# EAGLE design adi-interface(v2) (EAGLE 7.6.0)

## Sheet 1 of 2
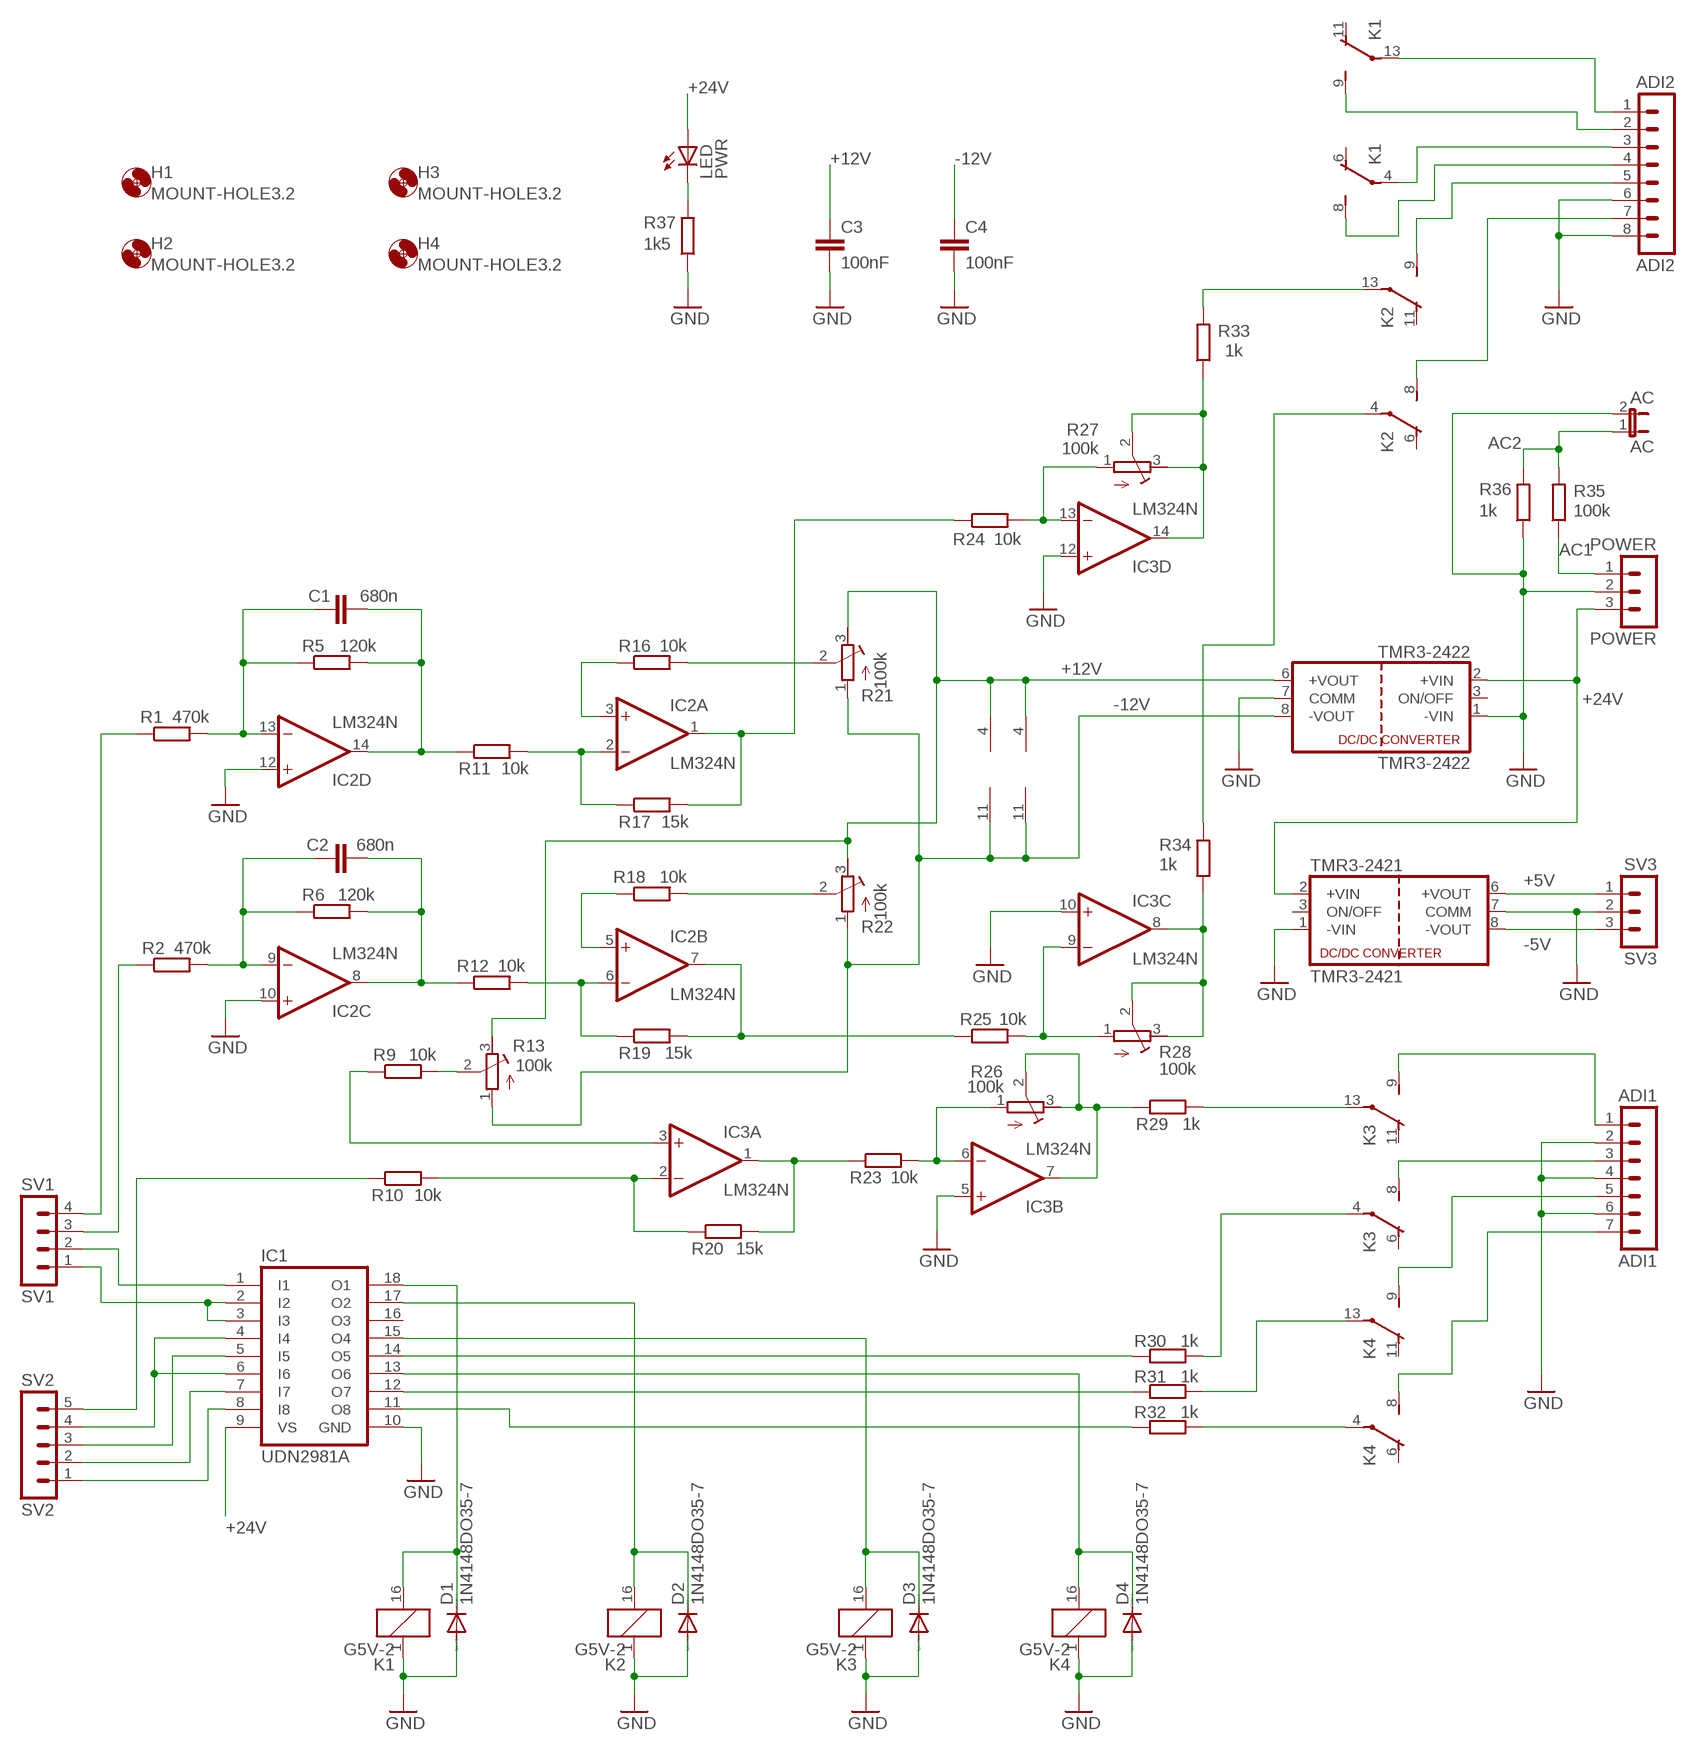
[diagram p0: schematic, sheet 1]

### Parts
AC  AC  JUMPER-2PTH  [1X02]
ADI1  ADI1  MA07-1  [MA07-1]
ADI2  ADI2  MA08-1  [MA08-1]
C1  680n  C-EU050-035X075  [C050-035X075]
C2  680n  C-EU050-035X075  [C050-035X075]
C3  100nF  C-EU025-024X044  [C025-024X044]
C4  100nF  C-EU025-024X044  [C025-024X044]
D1  1N4148DO35-7  [DO35-7]
D2  1N4148DO35-7  [DO35-7]
D3  1N4148DO35-7  [DO35-7]
D4  1N4148DO35-7  [DO35-7]
H1  MOUNT-HOLE3.2  [3,2]
H2  MOUNT-HOLE3.2  [3,2]
H3  MOUNT-HOLE3.2  [3,2]
H4  MOUNT-HOLE3.2  [3,2]
IC1  UDN2981A  [DIL18]
IC2  LM324N  [DIL14]
IC3  LM324N  [DIL14]
K1  G5V-2  [G5V-2]
K2  G5V-2  [G5V-2]
K3  G5V-2  [G5V-2]
K4  G5V-2  [G5V-2]
LED  PWR  LED3MM  [LED3MM]
POWER  POWER  MA03-1  [MA03-1]
R1  470k  R-EU_0204/7  [0204/7]
R2  470k  R-EU_0204/7  [0204/7]
R5  120k  R-EU_0204/7  [0204/7]
R6  120k  R-EU_0204/7  [0204/7]
R9  10k  R-EU_0204/7  [0204/7]
R10  10k  R-EU_0204/7  [0204/7]
R11  10k  R-EU_0204/7  [0204/7]
R12  10k  R-EU_0204/7  [0204/7]
R13  100k  R-TRIMM64Z  [RTRIM64Z]
R16  10k  R-EU_0204/7  [0204/7]
R17  15k  R-EU_0204/7  [0204/7]
R18  10k  R-EU_0204/7  [0204/7]
R19  15k  R-EU_0204/7  [0204/7]
R20  15k  R-EU_0204/7  [0204/7]
R21  100k  R-TRIMM64Z  [RTRIM64Z]
R22  100k  R-TRIMM64Z  [RTRIM64Z]
R23  10k  R-EU_0204/7  [0204/7]
R24  10k  R-EU_0204/7  [0204/7]
R25  10k  R-EU_0204/7  [0204/7]
R26  100k  R-TRIMM64Z  [RTRIM64Z]
R27  100k  R-TRIMM64Z  [RTRIM64Z]
R28  100k  R-TRIMM64Z  [RTRIM64Z]
R29  1k  R-EU_0204/7  [0204/7]
R30  1k  R-EU_0204/7  [0204/7]
R31  1k  R-EU_0204/7  [0204/7]
R32  1k  R-EU_0204/7  [0204/7]
R33  1k  R-EU_0204/7  [0204/7]
R34  1k  R-EU_0204/7  [0204/7]
R35  100k  R-EU_0204/7  [0204/7]
R36  1k  R-EU_0204/7  [0204/7]
R37  1k5  R-EU_0204/7  [0204/7]
SV1  SV1  MA04-1  [MA04-1]
SV2  SV2  MA05-1  [MA05-1]
SV3  SV3  MA03-1  [MA03-1]
TMR3-2421  TMR3-2421  TMR  [TRACO_SIP-8]
TMR3-2422  TMR3-2422  TMR  [TRACO_SIP-8]

### Nets
+5V [+5V]: SV3.1 TMR3-2421.6(+VOUT)
+12V [+12V]: C3.1 IC2.4(P:V+) IC3.4(P:V+) R13.3(E) R21.3(E) R22.3(E) TMR3-2422.6(+VOUT) ; also sheet 2
+24V [+24V]: IC1.9(VS) LED.A POWER.3 TMR3-2421.2(+VIN) TMR3-2422.2(+VIN)
-5V [-5V]: SV3.3 TMR3-2421.8(-VOUT)
-12V [-12V]: C4.1 IC2.11(P:V-) IC3.11(P:V-) R13.1(A) R21.1(A) R22.1(A) TMR3-2422.8(-VOUT) ; also sheet 2
AC1 [AC1]: POWER.1 R35.1
AC2 [AC2]: AC.1 R35.2 R36.2
GND [GND]: AC.2 ADI1.2 ADI1.4 ADI1.6 ADI2.6 ADI2.8 C3.2 C4.2 D1.A D2.A D3.A D4.A IC1.10(GND) IC2.10(C:+IN) IC2.12(D:+IN) IC3.5(B:+IN) IC3.10(C:+IN) IC3.12(D:+IN) K1.1 K2.1 K3.1 K4.1 POWER.2 R36.1 R37.1 SV3.2 TMR3-2421.1(-VIN) TMR3-2421.7(COMM) TMR3-2422.1(-VIN) TMR3-2422.7(COMM) ; also sheet 2
N$13: ADI2.1 K1.13(2:P)
N$14: ADI2.2 K1.9(2:S)
N$15: ADI2.3 K1.4(1:P)
N$16: ADI2.4 K1.8(1:S)
N$17: ADI2.5 K2.9(2:S)
N$18: ADI2.7 K2.8(1:S)
N$19: D1.C IC1.18(O1) K1.16
N$20: ADI1.1 K3.9(2:S)
N$21: D2.C IC1.17(O2) K2.16
N$22: ADI1.3 K3.8(1:S)
N$23: ADI1.5 K4.9(2:S)
N$24: ADI1.7 K4.8(1:S)
N$25: K3.4(1:P) R30.2
N$26: K4.13(2:P) R31.2
N$27: IC1.2(I2) IC1.3(I3) SV1.1
N$28: IC1.1(I1) SV1.2
N$29: K4.4(1:P) R32.2
N$30: D4.C IC1.13(O6) K4.16
N$31: D3.C IC1.15(O4) K3.16
N$32: IC1.11(O8) R32.1
N$33: IC1.12(O7) R31.1
N$34: R2.1 SV1.3
N$35: C2.1 IC2.9(C:-IN) R2.2 R6.1
N$36: C2.2 IC2.8(C:OUT) R6.2 R12.1
N$37: R1.1 SV1.4
N$38: IC2.2(A:-IN) R11.2 R17.1
N$39: C1.2 IC2.14(D:OUT) R5.2 R11.1
N$40: C1.1 IC2.13(D:-IN) R1.2 R5.1
N$41: K2.13(2:P) R33.2
N$42: IC2.1(A:OUT) R17.2 R24.1
N$43: IC2.6(B:-IN) R12.2 R19.1
N$44: K2.4(1:P) R34.2
N$45: IC2.7(B:OUT) R19.2 R25.1
N$46: IC2.3(A:+IN) R16.1
N$47: IC2.5(B:+IN) R18.1
N$48: R16.2 R21.2(S)
N$49: R18.2 R22.2(S)
N$50: LED.K(C) R37.2
N$52: IC3.6(B:-IN) R23.2 R26.1(A)
N$53: IC3.7(B:OUT) R26.2(S) R26.3(E) R29.1
N$54: IC3.13(D:-IN) R24.2 R27.1(A)
N$55: K3.13(2:P) R29.2
N$56: IC3.1(A:OUT) R20.2 R23.1
N$57: IC3.14(D:OUT) R27.2(S) R27.3(E) R33.1
N$58: R9.2 R13.2(S)
N$59: IC3.9(C:-IN) R25.2 R28.1(A)
N$60: IC3.8(C:OUT) R28.2(S) R28.3(E) R34.1
N$61: IC3.3(A:+IN) R9.1
N$62: R10.1 SV2.5
N$63: IC3.2(A:-IN) R10.2 R20.1
N$64: IC1.14(O5) R30.1
N$65: IC1.4(I4) IC1.6(I6) SV2.4
N$66: IC1.5(I5) SV2.3
N$67: IC1.7(I7) SV2.2
N$68: IC1.8(I8) SV2.1
Unconnected: IC1.16(O3) K1.6(1:O) K1.11(2:O) K2.6(1:O) K2.11(2:O) K3.6(1:O) K3.11(2:O) K4.6(1:O) K4.11(2:O) TMR3-2421.3(ON/OFF) TMR3-2422.3(ON/OFF)

## Sheet 2 of 2
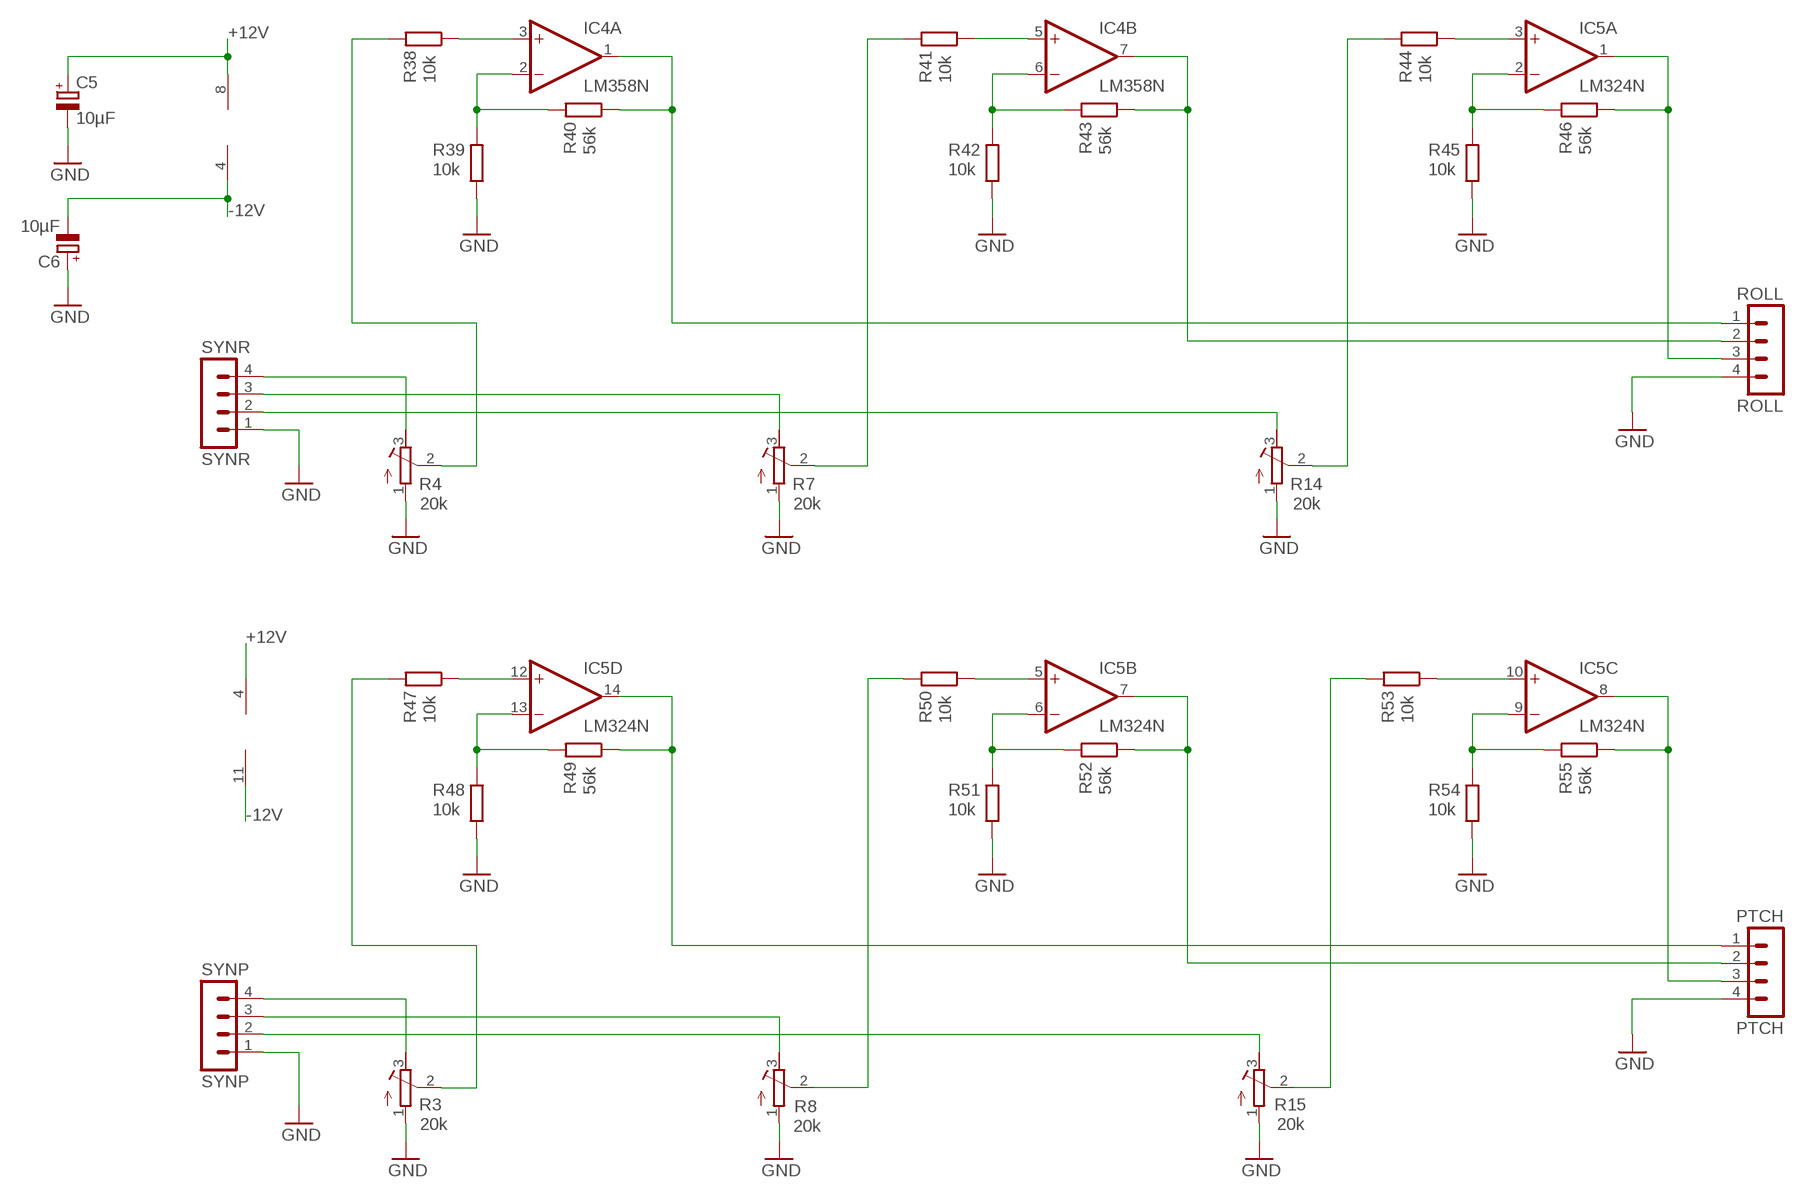
[diagram p1: schematic, sheet 2]

### Parts
C5  10µF  CPOL-EUE2.5-5  [E2,5-5]
C6  10µF  CPOL-EUE2.5-5  [E2,5-5]
IC4  LM358N  [DIL08]
IC5  LM324N  [DIL14]
PTCH  PTCH  MA04-1  [MA04-1]
R3  20k  R-TRIMM64Z  [RTRIM64Z]
R4  20k  R-TRIMM64Z  [RTRIM64Z]
R7  20k  R-TRIMM64Z  [RTRIM64Z]
R8  20k  R-TRIMM64Z  [RTRIM64Z]
R14  20k  R-TRIMM64Z  [RTRIM64Z]
R15  20k  R-TRIMM64Z  [RTRIM64Z]
R38  10k  R-EU_0204/7  [0204/7]
R39  10k  R-EU_0204/7  [0204/7]
R40  56k  R-EU_0204/7  [0204/7]
R41  10k  R-EU_0204/7  [0204/7]
R42  10k  R-EU_0204/7  [0204/7]
R43  56k  R-EU_0204/7  [0204/7]
R44  10k  R-EU_0204/7  [0204/7]
R45  10k  R-EU_0204/7  [0204/7]
R46  56k  R-EU_0204/7  [0204/7]
R47  10k  R-EU_0204/7  [0204/7]
R48  10k  R-EU_0204/7  [0204/7]
R49  56k  R-EU_0204/7  [0204/7]
R50  10k  R-EU_0204/7  [0204/7]
R51  10k  R-EU_0204/7  [0204/7]
R52  56k  R-EU_0204/7  [0204/7]
R53  10k  R-EU_0204/7  [0204/7]
R54  10k  R-EU_0204/7  [0204/7]
R55  56k  R-EU_0204/7  [0204/7]
ROLL  ROLL  MA04-1  [MA04-1]
SYNP  SYNP  MA04-1  [MA04-1]
SYNR  SYNR  MA04-1  [MA04-1]

### Nets
+12V [+12V]: C5.+ IC4.8(P:V+) IC5.4(P:V+) ; also sheet 1
-12V [-12V]: C6.- IC4.4(P:V-) IC5.11(P:V-) ; also sheet 1
GND [GND]: C5.- C6.+ PTCH.4 R3.1(A) R4.1(A) R7.1(A) R8.1(A) R14.1(A) R15.1(A) R39.1 R42.1 R45.1 R48.1 R51.1 R54.1 ROLL.4 SYNP.1 SYNR.1 ; also sheet 1
N$1: R14.3(E) SYNR.2
N$2: R7.3(E) SYNR.3
N$3: R4.3(E) SYNR.4
N$4: R3.3(E) SYNP.4
N$5: R8.3(E) SYNP.3
N$6: R15.3(E) SYNP.2
N$7: R8.2(S) R50.2
N$8: R7.2(S) R41.2
N$9: R4.2(S) R38.2
N$10: R15.2(S) R53.2
N$12: IC5.12(D:+IN) R47.1
N$51: IC4.3(A:+IN) R38.1
N$69: IC4.2(A:-IN) R39.2 R40.2
N$70: IC4.1(A:OUT) R40.1 ROLL.1
N$71: IC4.7(B:OUT) R43.1 ROLL.2
N$72: IC4.5(B:+IN) R41.1
N$73: IC4.6(B:-IN) R42.2 R43.2
N$74: IC5.3(A:+IN) R44.1
N$75: IC5.2(A:-IN) R45.2 R46.2
N$76: IC5.1(A:OUT) R46.1 ROLL.3
N$77: IC5.13(D:-IN) R48.2 R49.2
N$78: IC5.14(D:OUT) PTCH.1 R49.1
N$79: R3.2(S) R47.2
N$80: R14.2(S) R44.2
N$81: IC5.10(C:+IN) R53.1
N$82: IC5.5(B:+IN) R50.1
N$83: IC5.6(B:-IN) R51.2 R52.2
N$84: IC5.7(B:OUT) PTCH.2 R52.1
N$85: IC5.9(C:-IN) R54.2 R55.2
N$86: IC5.8(C:OUT) PTCH.3 R55.1

## Library data of the parts
AC = henk:JUMPER-2: Jumper Basic 0.1" spaced jumper. Use with breakaway headers.
ADI1 = con-lstb:MA07-1: PIN HEADER; OC_FARNELL: unknown; OC_NEWARK: unknown
ADI2 = con-lstb:MA08-1: PIN HEADER; OC_FARNELL: unknown; OC_NEWARK: unknown
C1-C4 = rcl:C-EU: CAPACITOR, European symbol
C5 C6 = rcl:CPOL-EU: POLARIZED CAPACITOR, European symbol
D1-D4 = diode:1N4148: DIODE high speed (Philips)
H1-H4 = holes:MOUNT-HOLE: MOUNTING HOLE with drill center marker
IC1 = uln-udn:UDN298*: DRIVER ARRAY Source: Allegro Microsystems Inc. / UDN2981-UDN2984.pdf
IC2 IC3 IC5 = linear:LM324: OP AMP
IC4 = linear:LM358: OP AMP also LM158; LM258; LM2904 Source: http://cache.national.com/ds/LM/LM158.pdf
K1-K4 = relay:G5V-2: OMRON PCB Relay Source: http://www.omron.com/ecb/products/pdf/en-g5v2.pdf; MPN: G5V-2 5DC; OC_FARNELL: 9949488; OC_NEWARK: 78K5703
LED = led:LED: LED OSRAM: - CHIPLED LG R971, LG N971, LY N971, LG Q971, LY Q971, LO R971, LY R971 LH N974, LH R974 LS Q976, LO Q976, LY Q976 LO Q996 - Hyper CHIPLED LW Q18S LB Q993, LB Q99A, LB R99A - SideLED LS A670, LO A670, LY A670, LG A670, LP A670 LB A673, LV A673, LT A673, LW A673 LH A674 LY A675 LS A676, LA A676, LO A676, LY A676, LW A676 LS A679, LY A679, LG A679 - Hyper Micro SIDELED® LS Y876, LA Y876, LO Y876, LY Y876 LT Y87S - SmartLED LW L88C, LW L88S LB L89C, LB L89S, LG L890 LS L89K, LO L89K, LY L89K LS L896, LA L896, LO L896, LY L896 - TOPLED LS T670, LO T670, LY T670, LG T670, LP T670 LSG T670, LSP T670, LSY T670, LOP T670, LYG T670 LG T671, LOG T671, LSG T671 LB T673, LV T673, LT T673, LW T673 LH T674 LS T676, LA T676, LO T676, LY T676, LB T676, LH T676, LSB T676, LW T676 LB T67C, LV T67C, LT T67C, LS T67K, LO T67K, LY T67K, LW E67C LS E67B, LA E67B, LO E67B, LY E67B, LB E67C, LV E67C, LT E67C LW T67C LS T679, LY T679, LG T679 LS T770, LO T770, LY T770, LG T770, LP T770 LB T773, LV T773, LT T773, LW T773 LH T774 LS E675, LA E675, LY E675, LS T675 LS T776, LA T776, LO T776, LY T776, LB T776 LHGB T686 LT T68C, LB T68C - Hyper Mini TOPLED® LB M676 - Mini TOPLED Santana® LG M470 LS M47K, LO M47K, LY M47K Source: http://www.osram.convergy.de LUXEON: - LUMILED® LXK2-PW12-R00, LXK2-PW12-S00, LXK2-PW14-U00, LXK2-PW14-V00 LXK2-PM12-R00, LXK2-PM12-S00, LXK2-PM14-U00 LXK2-PE12-Q00, LXK2-PE12-R00, LXK2-PE12-S00, LXK2-PE14-T00, LXK2-PE14-U00 LXK2-PB12-K00, LXK2-PB12-L00, LXK2-PB12-M00, LXK2-PB14-N00, LXK2-PB14-P00, LXK2-PB14-Q00 LXK2-PR12-L00, LXK2-PR12-M00, LXK2-PR14-Q00, LXK2-PR14-R00 LXK2-PD12-Q00, LXK2-PD12-R00, LXK2-PD12-S00 LXK2-PH12-R00, LXK2-PH12-S00 LXK2-PL12-P00, LXK2-PL12-Q00, LXK2-PL12-R00 Source: www.luxeon.com KINGBRIGHT: KA-3528ASYC Source: www.kingbright.com
POWER SV3 = con-lstb:MA03-1: PIN HEADER; OC_FARNELL: unknown; OC_NEWARK: unknown
PTCH ROLL SV1 SYNP SYNR = con-lstb:MA04-1: PIN HEADER; OC_FARNELL: unknown; OC_NEWARK: unknown
R1 R2 R5 R6 R9-R12 R16-R20 R23-R25 R29-R55 = rcl:R-EU_: RESISTOR, European symbol
R3 R4 R7 R8 R13-R15 R21 R22 R26-R28 = rcl:R-TRIMM: Trimm resistor
SV2 = con-lstb:MA05-1: PIN HEADER; OC_FARNELL: unknown; OC_NEWARK: unknown
TMR3-2421 TMR3-2422 = traco-tmr-dual:TMR

## Net classes
0 default: width 0.254 mm, clearance 0.254 mm
1 GND: width 1.016 mm, clearance 0.254 mm
2 +12V: width 0.508 mm, clearance 0.254 mm
3 -12V: width 0.508 mm, clearance 0.254 mm
4 +5V: width 0.762 mm, clearance 0.254 mm
5 -5V: width 0.762 mm, clearance 0.254 mm
6 +24V: width 1.016 mm, clearance 0.254 mm
7 AC1: width 0.254 mm, clearance 1.016 mm
8 AC2: width 0.254 mm, clearance 0.508 mm

## Board
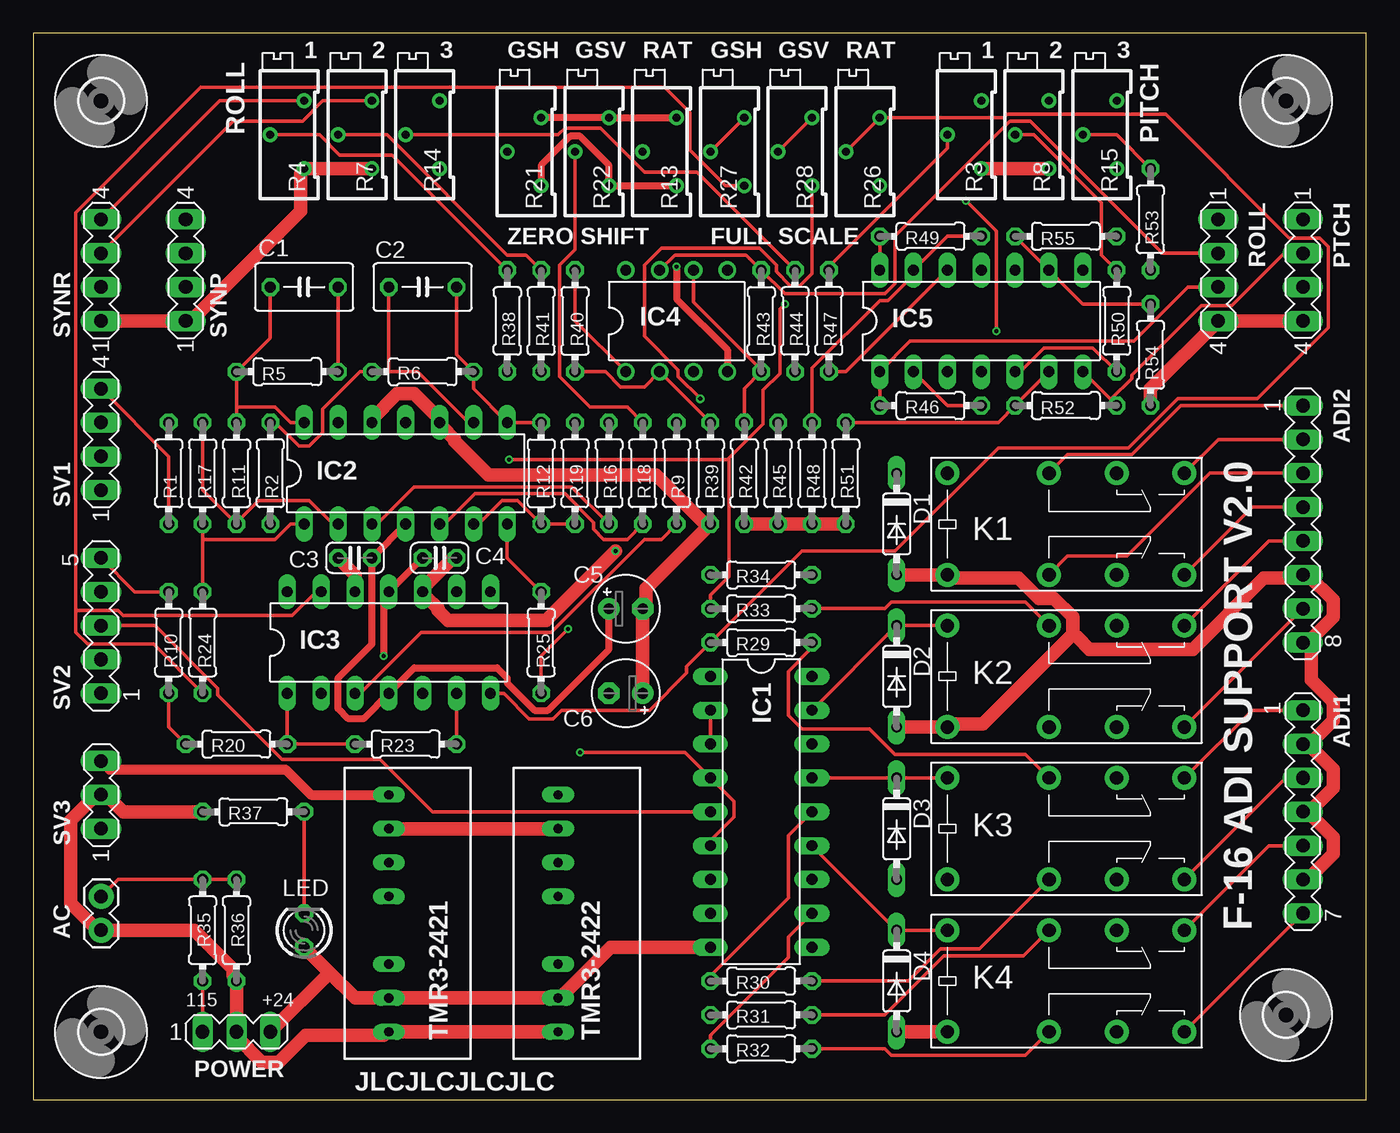
[diagram p2: board, top side]
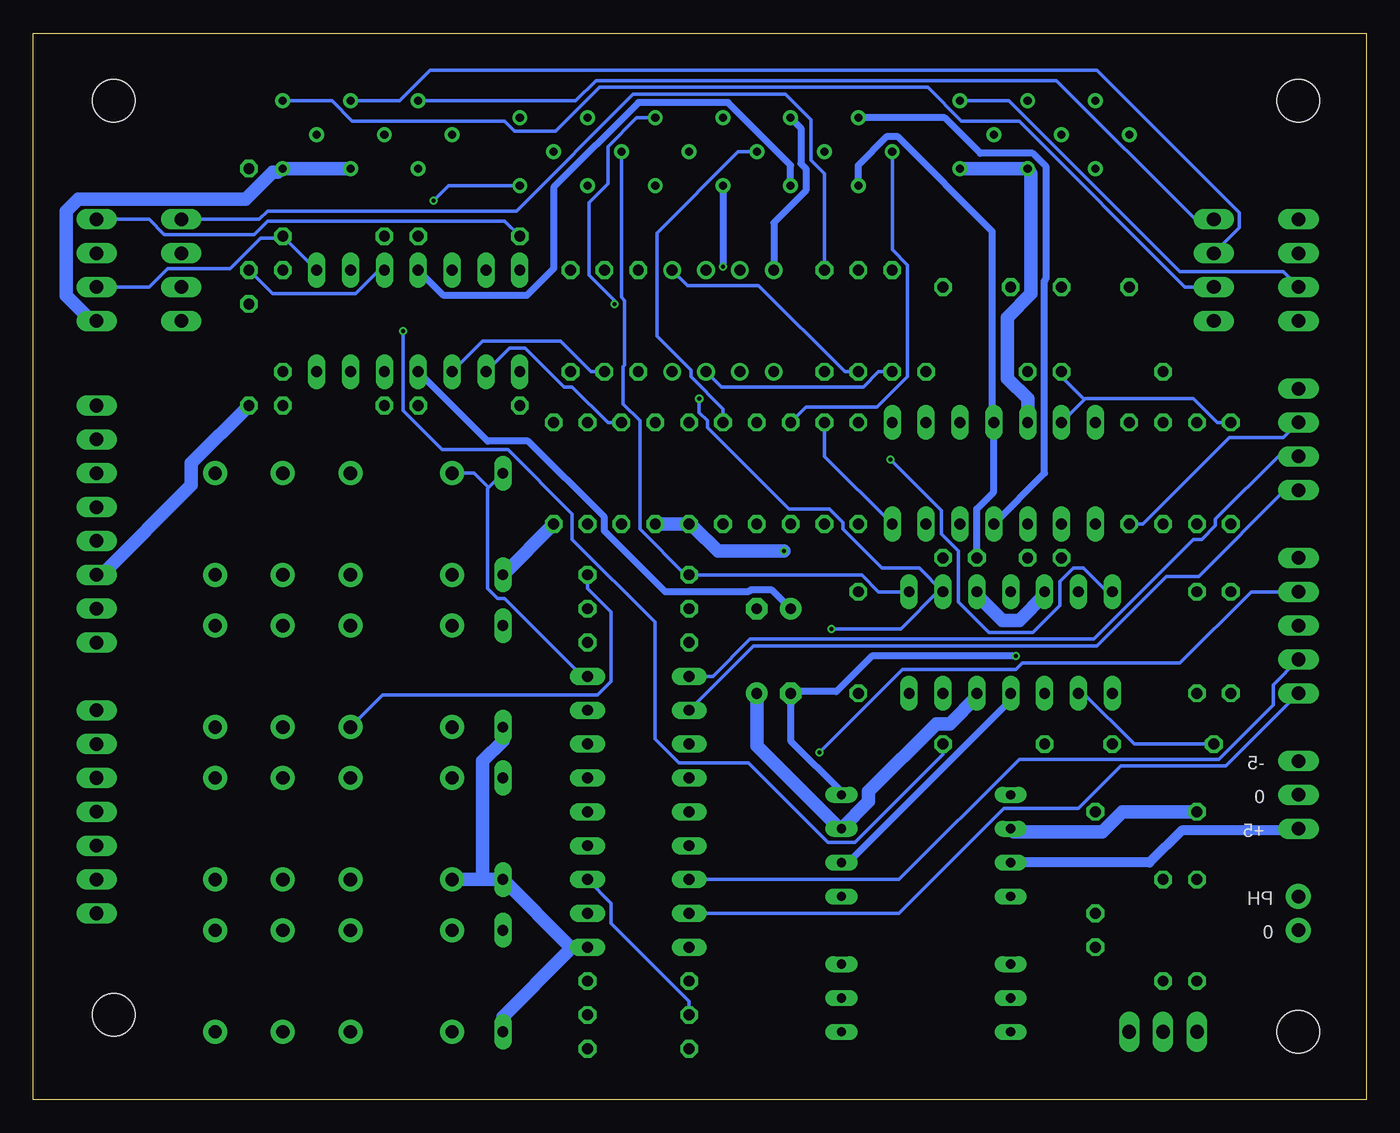
[diagram p3: board, bottom side, seen from below]

Size 100 x 80 mm. Coordinates in mm from the lower left corner, seen from the top.
Outline: 0,0 100,0 100,80 0,80 0,0
Copper layers (1*16): Top 0.035mm / dielectric 1.5mm / Bottom 0.035mm
Design rules "ITEADstudio_DRC": minimum track width 6mil, minimum drill 12mil, track to track 6mil, track to pad 6mil, pad to pad 6mil, via to via 6mil, smd to smd 0mil, copper to edge 10mil, drill to drill 10mil, minimum pad ring 10mil, minimum via ring 6mil, stop-mask expansion 2mil, vias tented up to drill 100mil, thermal gap 10mil

### Footprints (pad centres in the part's own frame; a part is rotated, then mirrored left to right if it is on the bottom)
1X02 = drill 1.016 pad 1.88: 1 0,0; 2 2.54,0
MA07-1 = drill 1.016 long: 1 -7.62,0; 2 -5.08,0; 3 -2.54,0; 4 0,0; 5 2.54,0; 6 5.08,0; 7 7.62,0
MA08-1 = drill 1.016 long: 1 -8.89,0; 2 -6.35,0; 3 -3.81,0; 4 -1.27,0; 5 1.27,0; 6 3.81,0; 7 6.35,0; 8 8.89,0
C050-035X075 = drill 0.813 octagon: 1 -2.54,0; 2 2.54,0
C025-024X044 = drill 0.813 octagon: 1 -1.27,0; 2 1.27,0
E2,5-5 = drill 0.813 pad 1.6: + -1.27,0 | drill 0.813 pad 1.6 octagon: - 1.27,0
DO35-7 = drill 0.813 long: A 3.81,0; C -3.81,0
3,2 = hole 3.2: 0,0
DIL18 = drill 0.813 long: 1 -10.16,-3.81; 2 -7.62,-3.81; 3 -5.08,-3.81; 4 -2.54,-3.81; 5 0,-3.81; 6 2.54,-3.81; 7 5.08,-3.81; 8 7.62,-3.81; 9 10.16,-3.81; 10 10.16,3.81; 11 7.62,3.81; 12 5.08,3.81; 13 2.54,3.81; 14 0,3.81; 15 -2.54,3.81; 16 -5.08,3.81; 17 -7.62,3.81; 18 -10.16,3.81
DIL14 = drill 0.813 long: 1 -7.62,-3.81; 2 -5.08,-3.81; 3 -2.54,-3.81; 4 0,-3.81; 5 2.54,-3.81; 6 5.08,-3.81; 7 7.62,-3.81; 8 7.62,3.81; 9 5.08,3.81; 10 2.54,3.81; 11 0,3.81; 12 -2.54,3.81; 13 -5.08,3.81; 14 -7.62,3.81
DIL08 = drill 0.813 pad 1.27: 1 -3.81,-3.81; 2 -1.27,-3.81; 3 1.27,-3.81; 4 3.81,-3.81; 5 3.81,3.81; 6 1.27,3.81; 7 -1.27,3.81; 8 -3.81,3.81
G5V-2 = drill 1 pad 1.8: 1 -8.89,-3.81; 4 -1.27,-3.81; 6 3.81,-3.81; 8 8.89,-3.81; 9 8.89,3.81; 11 3.81,3.81; 13 -1.27,3.81; 16 -8.89,3.81
LED3MM = drill 0.813 octagon: A -1.27,0; K 1.27,0
MA03-1 = drill 1.016 long: 1 -2.54,0; 2 0,0; 3 2.54,0
MA04-1 = drill 1.016 long: 1 -3.81,0; 2 -1.27,0; 3 1.27,0; 4 3.81,0
0204/7 = drill 0.813 octagon: 1 -3.81,0; 2 3.81,0
RTRIM64Z = drill 0.61: 1 0,-2.54; 2 -2.54,0; 3 0,2.54
MA05-1 = drill 1.016 long: 1 -5.08,0; 2 -2.54,0; 3 0,0; 4 2.54,0; 5 5.08,0
TRACO_SIP-8 = drill 0.7 long: 1 -8.89,0; 2 -6.35,0; 3 -3.81,0; 5 1.27,0; 6 3.81,0; 7 6.35,0; 8 8.89,0

### Placement (x,y rotation side)
AC  5.08,15.24 270 top
ADI1  95.25,21.59 270 top
ADI2  95.25,43.18 270 top
C1  20.32,60.96 180 top
C2  29.21,60.96 0 top
C3  24.13,40.64 180 top
C4  30.48,40.64 0 top
C5  44.45,36.83 0 top
C6  44.45,30.48 180 top
D1  64.77,43.18 270 top
D2  64.77,31.75 270 top
D3  64.77,20.32 270 top
D4  64.77,8.89 270 top
H1  5.08,74.93 0 top
H2  5.08,5.08 0 top
H3  93.98,6.35 0 top
H4  93.98,74.93 0 top
IC1  54.61,21.59 270 top
IC2  27.94,46.99 0 top
IC3  26.67,34.29 0 top
IC4  48.26,58.42 0 top
IC5  71.12,58.42 0 top
K1  77.47,43.18 0 top
K2  77.47,31.75 0 top
K3  77.47,20.32 0 top
K4  77.47,8.89 0 top
LED  20.32,12.7 90 top
POWER  15.24,5.08 0 top
PTCH  95.25,62.23 270 top
R1  10.16,46.99 90 top
R2  17.78,46.99 90 top
R3  71.12,72.39 0 top
R4  20.32,72.39 0 top
R5  19.05,54.61 180 top
R6  29.21,54.61 0 top
R7  25.4,72.39 0 top
R8  76.2,72.39 0 top
R9  48.26,46.99 90 top
R10  10.16,34.29 270 top
R11  15.24,46.99 270 top
R12  38.1,46.99 270 top
R13  48.26,71.12 0 top
R14  30.48,72.39 0 top
R15  81.28,72.39 0 top
R16  43.18,46.99 90 top
R17  12.7,46.99 270 top
R18  45.72,46.99 90 top
R19  40.64,46.99 90 top
R20  15.24,26.67 0 top
R21  38.1,71.12 0 top
R22  43.18,71.12 0 top
R23  27.94,26.67 0 top
R24  12.7,34.29 270 top
R25  38.1,34.29 270 top
R26  63.5,71.12 0 top
R27  53.34,71.12 0 top
R28  58.42,71.12 0 top
R29  54.61,34.29 0 top
R30  54.61,8.89 0 top
R31  54.61,6.35 0 top
R32  54.61,3.81 0 top
R33  54.61,36.83 0 top
R34  54.61,39.37 0 top
R35  12.7,12.7 90 top
R36  15.24,12.7 90 top
R37  16.51,21.59 0 top
R38  35.56,58.42 90 top
R39  50.8,46.99 90 top
R40  40.64,58.42 270 top
R41  38.1,58.42 90 top
R42  53.34,46.99 90 top
R43  54.61,58.42 270 top
R44  57.15,58.42 90 top
R45  55.88,46.99 90 top
R46  67.31,52.07 0 top
R47  59.69,58.42 90 top
R48  58.42,46.99 90 top
R49  67.31,64.77 0 top
R50  81.28,58.42 90 top
R51  60.96,46.99 90 top
R52  77.47,52.07 180 top
R53  83.82,66.04 90 top
R54  83.82,55.88 90 top
R55  77.47,64.77 180 top
ROLL  88.9,62.23 270 top
SV1  5.08,49.53 90 top
SV2  5.08,35.56 90 top
SV3  5.08,22.86 90 top
SYNP  11.43,62.23 90 top
SYNR  5.08,62.23 90 top
TMR3-2421  26.67,13.97 90 top
TMR3-2422  39.37,13.97 90 top

### Tracks (layer width: path | path; a pad name or v marks a point on that pad's centre or on a via)
+5V
  Bottom 0.762: TMR3-2421.6 16.26,17.78 13.84,20.19 5.21,20.19 SV3.1
+12V
  Top 0.508: R21.3 R22.3 R13.3 | IC2.4 C3.1 25.4,34.16 22.86,31.62 22.86,29.34 23.62,28.57 24.77,28.57 IC3.4 28.57,32.38 34.8,32.38 35.56,31.62 35.56,31.24 37.59,29.21 38.61,29.21 43.18,33.78 C5.+
  Bottom 0.508: IC5.4 65.91,49.4 62.87,49.4 57.15,43.69 57.15,42.67 52.58,38.1 46.35,38.1 46.23,38.23 44.58,38.23 C5.+ | IC4.8 44.45,65.79 42.04,68.2 42.04,69.85 42.42,70.23 42.42,72.9 R22.3 | TMR3-2422.6 38.86,17.78 26.67,29.97 IC3.4 | R21.3 31.62,73.66 28.96,70.99 25.02,70.99 24,69.98 24,61.59 24.13,61.47 24.13,46.99 IC2.4
+24V
  Top 1.016: LED.A 22.23,9.53 | 22.23,9.53 24.13,7.62 TMR3-2421.2 TMR3-2422.2 39.75,7.87 43.31,11.43 IC1.9 | 22.23,9.53 POWER.3
-5V
  Top 0.762: TMR3-2421.8 20.83,22.86 18.92,24.77 5.71,24.77 SV3.3
-12V  (via drill 0.3)
  Top 0.508: C4.1 IC3.11 26.29,37.72 v26.29,33.27 | R21.1 38.1,70.1 40.26,72.26 41.02,72.26 43.18,70.1 R22.1 R13.1 | IC4.4 52.07,56.26 48.26,60.07 v48.26,62.48
  Bottom 0.508: TMR3-2422.8 39.37,23.11 43.18,26.92 C6.- 43.05,30.61 39.75,30.61 37.08,33.27 v26.29,33.27 | C4.1 29.21,44.32 27.94,45.59 IC2.11 28.07,50.93 28.07,65.15 35.18,72.26 35.94,72.26 38.1,70.1 R21.1 | R13.1 v48.26,62.48 | IC5.11 69.22,60.33 62.99,60.33 60.96,62.36 60.96,68.45 54.61,74.8 47.88,74.8 43.18,70.1 R22.1
AC1
  Top 0.254: POWER.1 R35.1
AC2
  Top 0.254: R36.2 R35.2 6.35,16.51 AC.1
GND  (via drill 0.3)
  Top 1.016: ADI1.6 95.63,16.51 97.54,18.41 97.54,19.68 95.63,21.59 ADI1.4 96.01,21.84 97.54,23.37 97.54,24.77 95.63,26.67 ADI1.2 96.01,26.92 97.54,28.45 97.54,29.84 95.89,31.5 95.89,33.91 ADI2.8 95.63,34.29 97.54,36.2 97.54,37.47 95.63,39.37 ADI2.6 94.87,39.12 92.33,39.12 87,33.78 79.25,33.78 78.36,34.67 77.98,34.92 | R8.1 R3.1 | R54.1 83.82,53.34 ROLL.4 PTCH.4 | TMR3-2422.1 TMR3-2421.1 26.29,4.83 20.45,4.83 18.41,2.79 17.14,2.79 15.24,4.7 POWER.2 R36.1 14.99,9.27 14.99,9.78 12.06,12.7 AC.2 4.7,12.83 2.79,14.73 2.79,20.95 4.45,22.61 4.7,22.61 SV3.2 5.46,22.86 6.73,21.59 R37.1 | SYNR.1 SYNP.1 11.81,58.67 12.06,58.67 20.07,66.67 20.07,69.47 R4.1 R7.1 | IC2.12 25.4,51.05 27.3,52.96 28.57,52.96 30.48,51.05 IC2.10 30.73,50.42 31.62,49.53 31.62,49.4 34.16,46.86 46.74,46.86 50.29,43.31 R39.1 45.97,38.35 45.97,37.21 C5.- C6.+ | D2.A K2.1 68.96,28.19 71.25,28.19 77.98,34.92 | K4.1 D4.A | TMR3-2422.7 TMR3-2421.7 | IC3.12 24.13,39.37 C3.2 | C4.2 31.5,40.64 29.21,38.35 IC3.10 29.46,37.72 30.35,36.83 30.35,36.7 31.11,35.94 38.48,35.94 v43.69,41.15 | D1.A K1.1 68.96,39.12 73.91,39.12 75.44,37.59 76.58,37.59 77.98,36.2 77.98,34.92 | R42.1 R45.1 R48.1 R51.1
  Bottom 1.016: R8.1 R15.1 81.66,69.6 82.04,69.6 84.07,67.56 96.65,67.56 97.54,66.67 97.54,60.33 95.63,58.42 PTCH.4 | ADI2.6 94.87,39.37 88.14,46.1 88.14,47.75 R54.1 | R14.1 R7.1 25.15,69.47 25.15,60.45 26.92,58.67 26.92,54.1 25.4,52.58 IC2.12 | 59.69,11.43 IC1.10 | 59.69,11.43 D3.A 66.29,16.51 | 66.29,16.51 K3.1 | D4.A 64.77,6.22 59.94,11.05 59.69,11.43 | D2.A 64.77,26.92 66.29,25.4 66.29,16.51 | IC3.5 29.21,30.23 31.24,28.19 32.26,28.19 37.34,23.11 37.34,22.35 TMR3-2422.7 39.75,20.57 45.72,26.54 C6.+ | IC3.12 24.13,37.85 26.04,35.94 27.3,35.94 29.21,37.85 IC3.10 | R42.1 R39.1 50.42,42.93 48.64,41.15 v43.69,41.15 | R51.1 D1.A | R37.1 18.29,21.59 19.81,20.07 26.42,20.07 TMR3-2421.7
N$1
  Bottom 0.254: R14.3 26.8,74.93 13.97,62.1 6.22,62.1 SYNR.2
N$2
  Top 0.254: R7.3 21.72,74.93 20.19,73.41 14.99,73.41 SYNR.3
N$3
  Top 0.254: R4.3 13.97,74.93 SYNR.4
N$4
  Bottom 0.254: R3.3 59.31,74.93 57.78,76.45 23.24,76.45 12.83,66.04 SYNP.4
N$5
  Bottom 0.254: R8.3 72.52,74.93 70.23,77.22 20.19,77.22 9.53,66.55 9.53,65.41 SYNP.3
N$6
  Bottom 0.254: R15.3 77.6,74.93 76.07,73.41 64.64,73.41 63.88,72.64 60.83,72.64 57.53,75.95 32.89,75.95 30.35,73.41 26.04,73.41 13.59,60.96 SYNP.2
N$7
  Top 0.254: R8.2 75.06,72.39 80.14,67.31 80.14,63.37 R50.2
N$8
  Top 0.254: R7.2 26.54,72.39 35.56,63.37 36.96,63.37 R41.2
N$9
  Top 0.254: R4.2 21.46,72.39 22.99,70.87 26.92,70.87 R38.2
N$10
  Top 0.254: R15.2 81.28,72.39 R53.2
N$12
  Top 0.254: R47.1 60.96,54.61 IC5.12
N$13
  Top 0.254: ADI2.1 86.11,52.07 82.42,48.39 77.6,48.39 K1.13
N$14
  Top 0.254: ADI2.2 88.9,49.53 K1.9
N$15
  Top 0.254: ADI2.3 88.27,46.99 82.04,40.77 77.6,40.77 K1.4
N$16
  Top 0.254: ADI2.4 91.44,44.45 K1.8
N$17
  Top 0.254: ADI2.5 92.71,41.91 K2.9
N$18
  Top 0.254: K2.8 ADI2.7
N$19
  Bottom 0.254: IC1.18 58.8,31.75 64.64,37.59 65.15,37.59 65.91,38.35 65.91,45.85 65.85,45.91 | D1.C 65.85,45.91 | K1.16 66.93,46.99 65.85,45.91
N$20
  Top 0.254: ADI1.1 91.44,29.21 K3.9
N$21
  Top 0.254: IC1.17 D2.C K2.16
N$22
  Top 0.254: ADI1.3 93.98,24.13 K3.8
N$23
  Top 0.254: ADI1.5 92.71,19.05 K4.9
N$24
  Top 0.254: K4.8 ADI1.7
N$25
  Top 0.254: R30.2 65.66,8.89 68.07,11.3 70.99,11.3 K3.4
N$26
  Top 0.254: R31.2 63.88,6.35 68.33,10.79 74.3,10.79 K4.13
N$27
  Top 0.254: IC1.2 IC1.3
  Bottom 0.254: SV1.1 6.1,45.72 12.57,39.24 14.99,39.24 20.19,34.04 45.97,34.04 IC1.2
N$28
  Bottom 0.254: IC1.1 49.02,31.75 46.23,34.54 20.45,34.54 12.95,42.04 12.32,42.04 11.3,43.05 11.3,43.56 6.6,48.26 SV1.2
N$29
  Top 0.254: R32.2 63.88,3.81 64.39,3.3 74.42,3.3 K4.4
N$30
  Top 0.254: K4.16 D4.C IC1.13
N$31
  Top 0.254: IC1.15 D3.C K3.16
N$32
  Top 0.254: R32.1 50.8,4.83 56.64,10.67 56.64,12.19 IC1.11
N$33
  Bottom 0.254: R31.1 50.8,7.37 56.64,13.21 56.64,14.73 IC1.12
N$34
  Bottom 0.254: R2.1 16.76,43.18 10.29,49.66 6.22,49.66 SV1.3
N$35
  Top 0.254: R2.2 18.16,50.8 19.94,49.02 20.7,49.02 21.72,50.04 21.72,51.82 24.51,54.61 R6.1 26.67,54.61 | IC2.9 32.64,50.8 28.83,54.61 26.67,54.61 | 26.67,54.61 C2.1
N$36
  Top 0.254: R12.1 IC2.8 33.02,53.34 R6.2 31.75,55.88 C2.2
N$37
  Top 0.254: R1.1 10.16,48.26 SV1.4
N$38
  Top 0.254: R17.1 12.7,45.72 R11.2 15.24,43.31 16.89,44.96 20.7,44.96 22.48,43.18 IC2.2
N$39
  Top 0.254: 15.24,51.94 R5.2 17.78,57.15 C1.2 | 15.24,51.94 R11.1 | IC2.14 19.3,50.8 18.16,51.94 15.24,51.94
N$40
  Top 0.254: R5.1 C1.1
  Bottom 0.254: R1.2 11.18,50.8 12.95,52.58 21.08,52.58 21.14,52.51 | IC2.13 21.14,52.51 | R5.1 22.86,54.23 21.14,52.51
N$41
  Top 0.254: R33.2 63.88,36.83 64.39,37.34 74.42,37.34 K2.13
N$42
  Top 0.254: R17.2 12.7,42.04 | 12.7,42.04 R24.1 | IC2.1 19.3,43.18 18.16,42.04 12.7,42.04
N$43
  Top 0.254: IC2.6 33.4,43.18 35.18,44.96 36.32,44.96 R12.2 R19.1
N$44
  Bottom 0.254: R34.2 58.42,38.35 56.64,36.58 56.64,31.37 57.66,30.35 73.79,30.35 K2.4
N$45
  Top 0.254: IC2.7 35.56,40.64 R25.1
  Bottom 0.254: R19.2 40.64,48.26 IC2.7
N$46
  Top 0.254: IC2.3 25.78,43.18 28.57,45.97 40.39,45.97 R16.1
N$47
  Top 0.254: IC2.5 30.86,43.18 33.15,45.47 39.88,45.47 42.04,43.31 42.04,42.8 42.8,42.04 44.58,42.04 R18.1
N$48
  Bottom 0.254: R21.2 35.56,63.75 34.42,62.61 34.42,54.23 36.7,51.94 42.04,51.94 R16.2
N$49
  Top 0.254: R22.2 40.64,63.75 39.5,62.61 39.5,54.23 41.78,51.94 44.58,51.94 R18.2
N$50
  Top 0.254: R37.2 LED.K
N$51
  Bottom 0.254: R38.1 36.58,54.61 37.72,53.47 48.39,53.47 IC4.3
N$52  (via drill 0.3)
  Top 0.254: v69.98,67.44 72.26,65.15 v72.26,57.66 | R23.2 IC3.6
  Bottom 0.254: R26.1 68.83,68.58 v69.98,67.44 | v72.26,57.66 72.26,51.69 69.34,48.77 64.39,48.77 59.56,43.94 59.56,42.04 53.34,35.81 53.34,27.05 51.56,25.27 46.35,25.27 40.39,19.3 38.35,19.3 31.75,25.91 R23.2
N$53
  Top 0.254: R26.2 R26.3 72.77,73.66 73.03,73.91 84.96,73.91 94.23,64.64 96.52,64.64 97.16,64.01 97.16,57.91 91.82,52.58 85.85,52.58 82.17,48.9 72.39,48.9 64.64,41.15 57.66,41.15 R29.1 49.02,32.51 49.02,32 46.23,29.21 39.62,29.21 38.99,28.57 37.21,28.57 35.31,30.48 IC3.7
N$54
  Top 0.254: R27.1 51.94,68.58 49.28,71.25 49.28,74.04 47.37,75.95 12.57,75.95 3.17,66.55 3.17,36.7 | 3.17,36.7 3.17,35.05 4.06,34.16 9.02,34.16 R24.2 | IC3.13 21.21,38.1 19.43,36.32 6.73,36.32 6.35,36.7 3.17,36.7
N$55
  Top 0.254: R29.2 58.42,33.91 56.64,32.13 56.64,28.83 57.66,27.81 62.74,27.81 64.64,25.91 74.42,25.91 K3.13
N$56
  Top 0.254: IC3.1 R20.2 R23.1
N$57  (via drill 0.3)
  Top 0.254: R27.3 R27.2 | R33.1 50.8,37.85 52.2,39.24 52.2,48.01 | 52.2,48.01 52.2,48.13 54.74,50.67 54.74,53.21 56.01,54.48 56.01,59.31 v56.39,59.69 | 52.2,48.01 v35.69,48.01
  Bottom 0.254: v56.39,59.69 56.39,59.94 58.29,61.85 58.29,67.31 56.9,68.71 56.9,71.5 54.74,73.66 R27.3 | IC3.14 19.43,38.1 21.21,39.88 21.97,39.88 22.99,38.86 22.99,37.08 25.02,35.05 28.32,35.05 30.61,37.34 30.61,41.15 31.88,42.42 31.88,44.2 v35.69,48.01
N$58
  Bottom 0.254: R13.2 47.12,71.12 53.21,65.02 53.21,57.28 50.67,54.74 50.67,54.23 48.26,51.82 R9.2
N$59  (via drill 0.3)
  Top 0.254: R28.1 58.42,61.98 57.53,61.09 56.77,61.09 55.75,62.1 55.75,62.61 54.48,63.88 47.12,63.88 45.85,62.61 45.85,57.28 48.39,54.74 48.39,54.23 v50.04,52.58 | R25.2 38.1,33.27 v40.13,35.31
  Bottom 0.254: v50.04,52.58 50.04,51.56 49.4,50.93 49.4,50.42 43.31,44.32 40.26,44.32 39.24,43.31 39.24,42.8 36.32,39.88 33.53,39.88 IC3.9 32,38.23 34.92,35.31 v40.13,35.31
N$60
  Top 0.254: R28.3 R28.2
  Bottom 0.254: IC3.8 36.58,38.1 37.85,39.37 R34.1 51.05,39.37 54.48,42.8 54.48,50.93 55.75,52.2 55.75,54.99 55.63,55.12 55.63,59.94 55.88,60.2 R28.2
N$61
  Top 0.254: IC3.3 24.51,30.48 29.08,35.05 38.86,35.05 45.85,42.04 47.12,42.04 R9.1
N$62
  Top 0.254: R10.1 7.62,38.1 SV2.5
N$63
  Top 0.254: R10.2 10.16,27.94 R20.1
  Bottom 0.254: IC3.2 21.21,30.48 17.4,26.67 R20.1
N$64
  Top 0.254: R30.1 50.8,9.27 56.64,15.11 56.64,19.81 IC1.14
N$65  (via drill 0.3)
  Top 0.254: IC1.6 50.8,19.43 52.58,21.21 52.58,22.35 IC1.4 48.9,26.04 v41.02,26.04
  Bottom 0.254: SV2.4 8.64,38.1 13.97,32.77 25.78,32.77 26.29,32.26 34.8,32.26 v41.02,26.04
N$66
  Top 0.254: IC1.5 29.97,21.59 26.04,25.53 18.67,25.53 13.84,30.35 13.84,30.86 9.14,35.56 SV2.3
N$67
  Bottom 0.254: IC1.7 35.05,16.51 26.04,25.53 11.05,25.53 6.99,29.59 6.99,31.11 SV2.2
N$68
  Bottom 0.254: IC1.8 35.05,13.97 27.18,21.84 21.59,21.84 18.41,25.02 10.54,25.02 SV2.1
N$69
  Top 0.254: R40.2 42.93,54.61 44.07,53.47 45.85,53.47 IC4.2 R39.2
N$70
  Top 0.254: R40.1 40.64,58.42 IC4.1
  Bottom 0.254: ROLL.1 83.06,66.04 82.42,66.67 63.75,66.67 54.99,75.44 43.56,75.44 41.66,73.53 41.66,70.48 40.64,69.47 R40.1
N$71
  Top 0.254: IC4.7 48.13,63.37 53.47,63.37 R43.1 56.39,60.45 63.88,60.45 64.64,61.21 64.64,64.77 73.28,73.41 74.8,73.41 84.71,63.5 ROLL.2
N$72
  Bottom 0.254: R41.1 39.12,54.61 45.59,61.09 50.93,61.09 IC4.5
N$73
  Top 0.254: R42.2 53.34,53.34 R43.2 54.48,54.61 54.48,54.86 49.53,59.82 IC4.6
N$74
  Bottom 0.254: R44.1 58.17,54.61 60.45,56.9 66.29,56.9 IC5.3
N$75
  Top 0.254: R46.2 68.58,52.07 IC5.2
  Bottom 0.254: R45.2 56.9,50.8 59.56,53.47 60.2,53.47 63.12,56.39 64.26,56.39 IC5.2
N$76
  Top 0.254: R46.1 IC5.1 65.79,56.9 82.55,56.9 86.61,60.96 ROLL.3
N$77
  Top 0.254: R48.2 58.42,54.86 63.5,59.94 64.14,59.94 66.04,61.85 IC5.13 68.58,64.77 R49.2
N$78
  Top 0.254: R49.1 IC5.14
  Bottom 0.254: PTCH.1 91.31,66.04 90.17,64.9 83.44,64.9 82.42,65.91 64.64,65.91 R49.1
N$79
  Top 0.254: R3.2 68.58,71.37 59.69,62.48 R47.2
N$80
  Top 0.254: R14.2 39.37,72.39 39.88,72.9 42.55,72.9 45.85,69.6 49.78,69.6 R44.2
N$81
  Bottom 0.254: IC5.10 74.04,62.23 75.82,60.45 82.04,60.45 R53.1
N$82
  Top 0.254: IC5.5 74.04,54.61 75.82,56.39 79.5,56.39 R50.1
N$83
  Top 0.254: R51.2 72.39,50.8 R52.2 IC5.6
N$84
  Top 0.254: IC5.7 R52.1 80.9,52.58 82.42,54.1 82.42,54.36 87.63,59.56 89.92,59.56 93.85,63.5 PTCH.2
N$85
  Top 0.254: R55.2 IC5.9 78.74,59.69 R54.2
N$86
  Bottom 0.254: IC5.8 R55.1 81.28,64.64 82.93,64.64 85.22,62.36 89.92,62.36 91.31,60.96 PTCH.3

### Text on the board
tNames: 1 | 2 | 3 | GSH | GSV | RAT | GSH | GSV | RAT | 1 | 2 | 3 | ROLL | PITCH | ZERO SHIFT | FULL SCALE | F-16 ADI SUPPORT V2.0 | 115 | +24 | TMR3-2421 | TMR3-2422 | JLCJLCJLCJLC
bNames: -5 | 0 | +5 | PH | 0